# EAGLE schematic PZ (EAGLE 7.6.0)
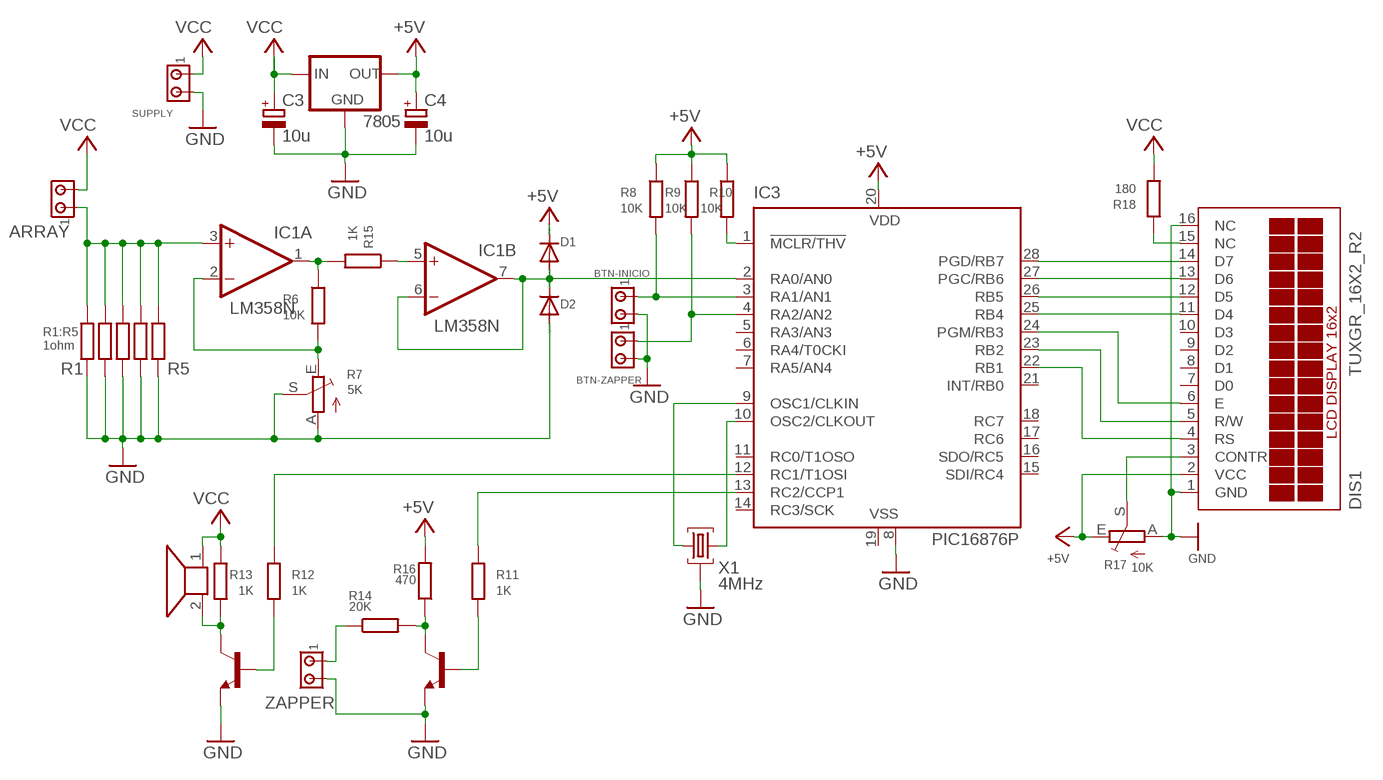
[diagram p0: schematic, sheet 1]

## Parts
7805  78XXL  [78XXL]
ARRAY  MTA02-156  [1X2MTA]
BTN-INICIO  MTA02-100  [10X02MTA]
BTN-ZAPPER  MTA02-100  [10X02MTA]
C3  10u  CPOL-EUE1.8-4  [E1,8-4]
C4  10u  CPOL-EUE1.8-4  [E1,8-4]
D1  1N4148  1N4148DO35-7  [DO35-7]
D2  1N4148  1N4148DO35-7  [DO35-7]
DIS1  TUXGR_16X2_R2  [TUXGR_16X2_R2]
IC1  LM358N  [DIL08]
IC3  PIC16876P  [DIL28-3]
Q2  2N3904  [TO92]
Q3  2N3904  [TO92]
R1  1  R-EU_0204/7  [0204/7]
R2  1  R-EU_0204/7  [0204/7]
R3  1  R-EU_0204/7  [0204/7]
R4  1  R-EU_0204/7  [0204/7]
R5  1  R-EU_0204/7  [0204/7]
R6  10K  R-EU_0204/7  [0204/7]
R7  5K  TRIM_EU-B25P  [B25P]
R8  10K  R-EU_0204/7  [0204/7]
R9  10K  R-EU_0204/7  [0204/7]
R10  10K  R-EU_0204/7  [0204/7]
R11  1K  R-EU_0204/7  [0204/7]
R12  1K  R-EU_0204/7  [0204/7]
R13  1K  R-EU_0204/7  [0204/7]
R14  20K  R-EU_0204/7  [0204/7]
R15  1K  R-EU_0204/7  [0204/7]
R16  470  R-EU_0204/7  [0204/7]
R17  10K  TRIM_EU-B25P  [B25P]
R18  180  R-EU_0204/7  [0204/7]
SP1  AL60P  [AL60P]
SUPPLY  MTA02-100  [10X02MTA]
X1  4MHz  8M10AHC49T  [HC49U]
ZAPPER  MTA02-156  [1X2MTA]

## Nets
+5V: 7805.OUT C4.+ D1.C DIS1.2(VCC) IC3.20(VDD) R8.1 R9.1 R10.1 R16.2 R17.E
GND: 7805.GND BTN-INICIO.2 BTN-ZAPPER.2 C3.- C4.- D2.A DIS1.1(GND) DIS1.16(NC) IC3.8(VSS) Q2.3(E) Q3.3(E) R1.2 R2.2 R3.2 R4.2 R5.2 R7.A R7.S R17.A SUPPLY.2 X1.2 ZAPPER.2
N$1: ARRAY.1 IC1.3(A:+IN) R1.1 R2.1 R3.1 R4.1 R5.1
N$2: D1.A D2.C IC1.6(B:-IN) IC1.7(B:OUT) IC3.2(RA0/AN0)
N$3: IC1.5(B:+IN) R15.1
N$4: IC1.1(A:OUT) R6.1 R15.2
N$5: IC1.2(A:-IN) R6.2 R7.E
N$6: IC3.1(!MCLR/THV) R10.2
N$7: IC3.10(OSC2/CLKOUT) X1.3
N$8: BTN-INICIO.1 IC3.3(RA1/AN1) R8.2
N$10: IC3.12(RC1/T1OSI) R12.1
N$11: BTN-ZAPPER.1 IC3.4(RA2/AN2) R9.2
N$13: Q2.2(B) R11.2
N$14: Q3.2(B) R12.2
N$15: Q3.1(C) R13.2 SP1.2
N$18: R14.1 ZAPPER.1
N$19: Q2.1(C) R14.2 R16.1
N$20: DIS1.14(D7) IC3.28(PGD/RB7)
N$21: DIS1.13(D6) IC3.27(PGC/RB6)
N$22: DIS1.12(D5) IC3.26(RB5)
N$23: DIS1.11(D4) IC3.25(RB4)
N$24: DIS1.6(E) IC3.24(PGM/RB3)
N$25: DIS1.5(R/W) IC3.23(RB2)
N$26: DIS1.4(RS) IC3.22(RB1)
N$27: DIS1.15(NC) R18.1
N$28: DIS1.3(CONTR) R17.S
N$29: IC3.13(RC2/CCP1) R11.1
N$30: IC3.9(OSC1/CLKIN) X1.1
VCC: 7805.IN ARRAY.2 C3.+ R13.1 R18.2 SP1.1 SUPPLY.1
Unconnected: DIS1.7(D0) DIS1.8(D1) DIS1.9(D2) DIS1.10(D3) IC3.5(RA3/AN3) IC3.6(RA4/T0CKI) IC3.7(RA5/AN4) IC3.11(RC0/T1OSO) IC3.14(RC3/SCK) IC3.15(SDI/RC4) IC3.16(SDO/RC5) IC3.17(RC6) IC3.18(RC7) IC3.21(INT/RB0)

## Notes on the sheet
- R1:R5
  1ohm

## Power pins joined to a net without a drawn wire
V+: IC1.8(P:V+)
V-: IC1.4(P:V-)
VSS: IC3.19(VSS)

## Library data of the parts
7805 = v-reg:78XXL: VOLTAGE REGULATOR
ARRAY ZAPPER = con-amp:MTA02-156: AMP connector
BTN-INICIO BTN-ZAPPER SUPPLY = con-amp:MTA02-100: AMP connector
C3 C4 = rcl:CPOL-EU: POLARIZED CAPACITOR, European symbol
D1 D2 = diode:1N4148: DIODE high speed (Philips)
DIS1 = display-lcd:TUXGR_16X2_R2: Tuxgraphics LCD display 16x2 characters reflective, without background light Source: tuxgr_12x2_r2.pdf; OC_FARNELL: unknown; OC_NEWARK: unknown
IC1 = linear:LM358: OP AMP also LM158; LM258; LM2904 Source: http://cache.national.com/ds/LM/LM158.pdf
IC3 = microchip:PIC16*876: MICROCONTROLLER flash type; OC_FARNELL: unknown; OC_NEWARK: unknown
Q2 Q3 = transistor-npn:2N3904: NPN Transistor
R1-R6 R8-R16 R18 = rcl:R-EU_: RESISTOR, European symbol
R7 R17 = pot:TRIM_EU-: POTENTIOMETER
SP1 = buzzer:AL60P: SPEAKER Source: Buerklin; OC_FARNELL: unknown; OC_NEWARK: unknown
X1 = crystal:8M10AHC49T: Monolithic Crystal Filters Source: www.vanlong.com; OC_FARNELL: unknown; OC_NEWARK: unknown